# EAGLE design ghetto_distortion (EAGLE 8.6.0)
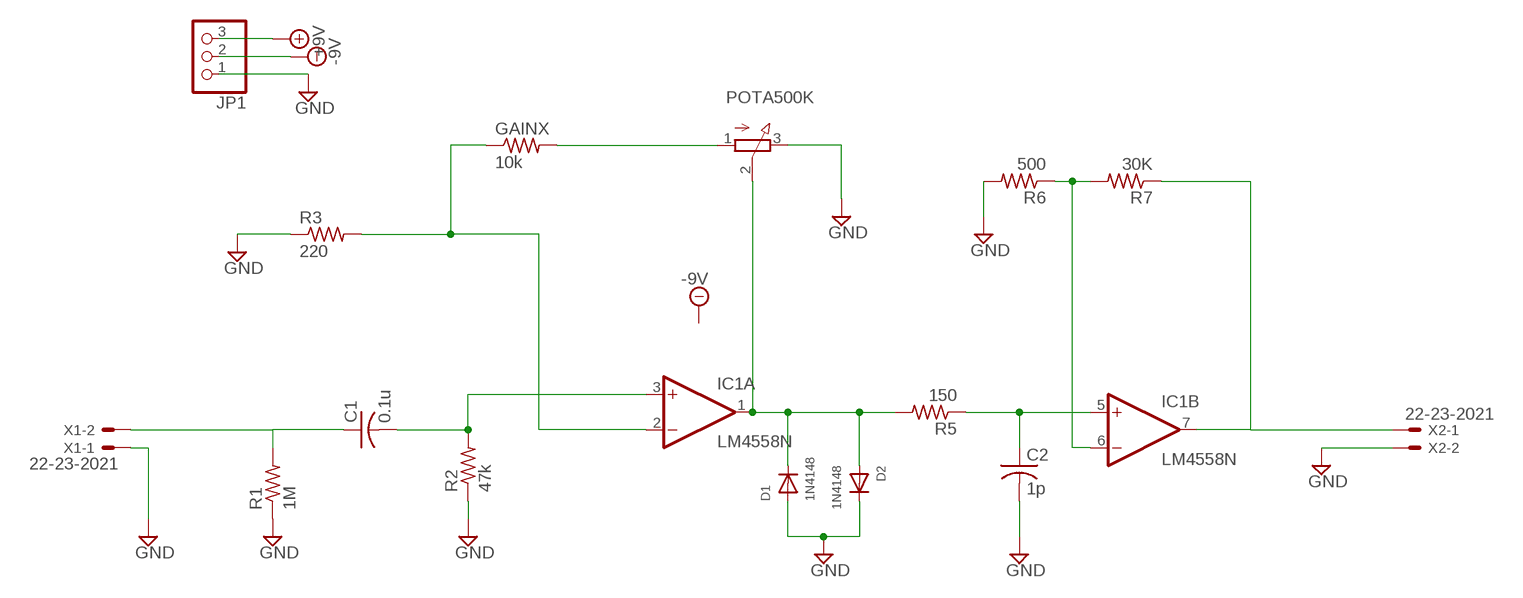
[diagram p0: schematic, sheet 1]

## Parts
C1  0.1u  C-US050-024X044  [C050-024X044]
C2  1p  C-US050-024X044  [C050-024X044]
D1  1N4148  DIODEDO-1N4148  [DO-1N4148]
D2  1N4148  DIODEDO-1N4148  [DO-1N4148]
GAINX  10k  R-US_0204/7  [0204/7]
IC1  LM4558N  [DIL08]
JP1  PINHD-1X3  [1X03]
POTA500K  3RP/1610N  [3RP/1610N]
R1  1M  R-US_0204/7  [0204/7]
R2  47k  R-US_0204/7  [0204/7]
R3  220  R-US_0204/7  [0204/7]
R5  150  R-US_0204/7  [0204/7]
R6  500  R-US_0204/7  [0204/7]
R7  30K  R-US_0204/7  [0204/7]
X1  22-23-2021  [22-23-2021]
X2  22-23-2021  [22-23-2021]

## Nets
GND: C2.2 D1.A D2.C JP1.1 POTA500K.3(E) R1.1 R2.1 R3.1 R6.2 X1.1 X2.2
N$1: C1.2 IC1.3(A:+IN) R2.2
N$2: C1.1 R1.2 X1.2
N$3: GAINX.1 IC1.2(A:-IN) R3.2
N$4: D1.C D2.A IC1.1(A:OUT) POTA500K.2(S) R5.2
N$5: C2.1 IC1.5(B:+IN) R5.1
N$6: IC1.7(B:OUT) R7.1 X2.1
N$7: GAINX.2 POTA500K.1(A)
N$8: IC1.6(B:-IN) R6.1 R7.2
V+: JP1.3 ; supply symbol labelled +9V
V-: JP1.2 ; supply symbol labelled -9V

## Power pins joined to a net without a drawn wire
V+: IC1.8(P:V+)
V-: IC1.4(P:V-)

## Library data of the parts
C1 C2 = resistor:C-US: CAPACITOR, American symbol
D1 D2 = adafruit:DIODE: Diode SMADIODE - SMA Surface Mount Package 20V 1A Schottky Diode Digikey: 641-1014-6-ND DO-1N4148 - Through Hole Small Current Diode SOD-123 20V 1 A (.5mV Vf) Schottky Diode - Digikey: MBRX120TPMSCT-ND SOD-323 10V 570mA (.38mV Vf, 3ns) Schottky Diode - Digikey: ZLLS410CT-ND SOD-523 30V 30mA Schottky Diode (RB751S-40TE61) - Digikey: RB751S-40TE61CT-ND SOT23-R/W - SOT23 Package (R = Solder Paste/Reflow Ovens, W = Hand-Soldering) BAT54Film 40V 300mA - Digikey: 497-7162-1-ND
GAINX R1-R3 R5-R7 = resistor:R-US_: RESISTOR, American symbol
IC1 = linear:*4558: OP AMP
JP1 = adafruit:PINHD-1X3: PIN HEADER
POTA500K = pot:3RP/1610N: 16mm Potentiometer one level Source: http://www.alphapotentiometers.net/html/16mm_pot_2.html
X1 X2 = con-molex:22-23-2021: .100" (2.54mm) Center Header - 2 Pin; MF: MOLEX; MPN: 22-23-2021; OC_FARNELL: 1462926; OC_NEWARK: 25C3832

## Board
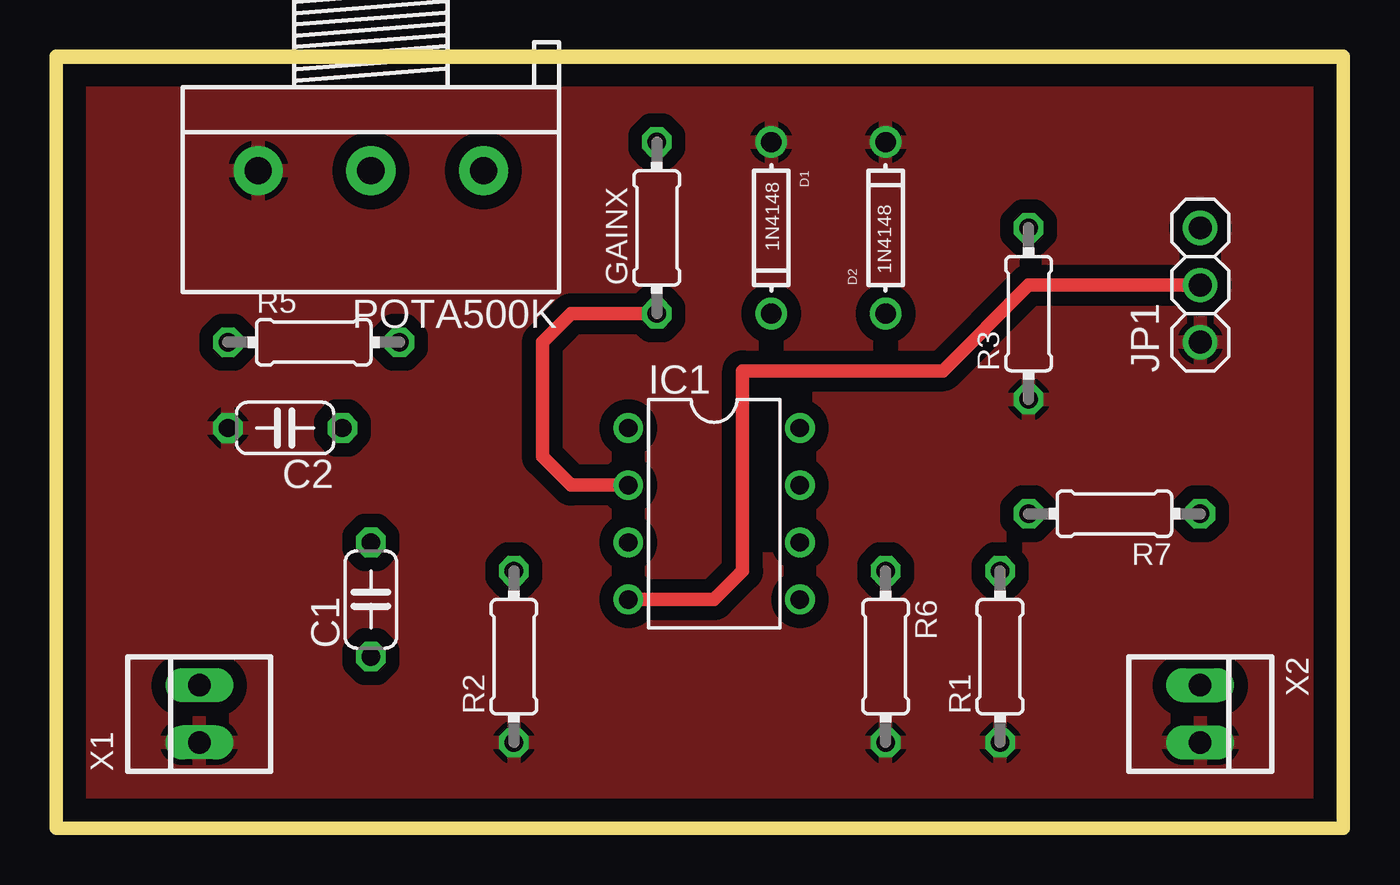
[diagram p1: board, top side]
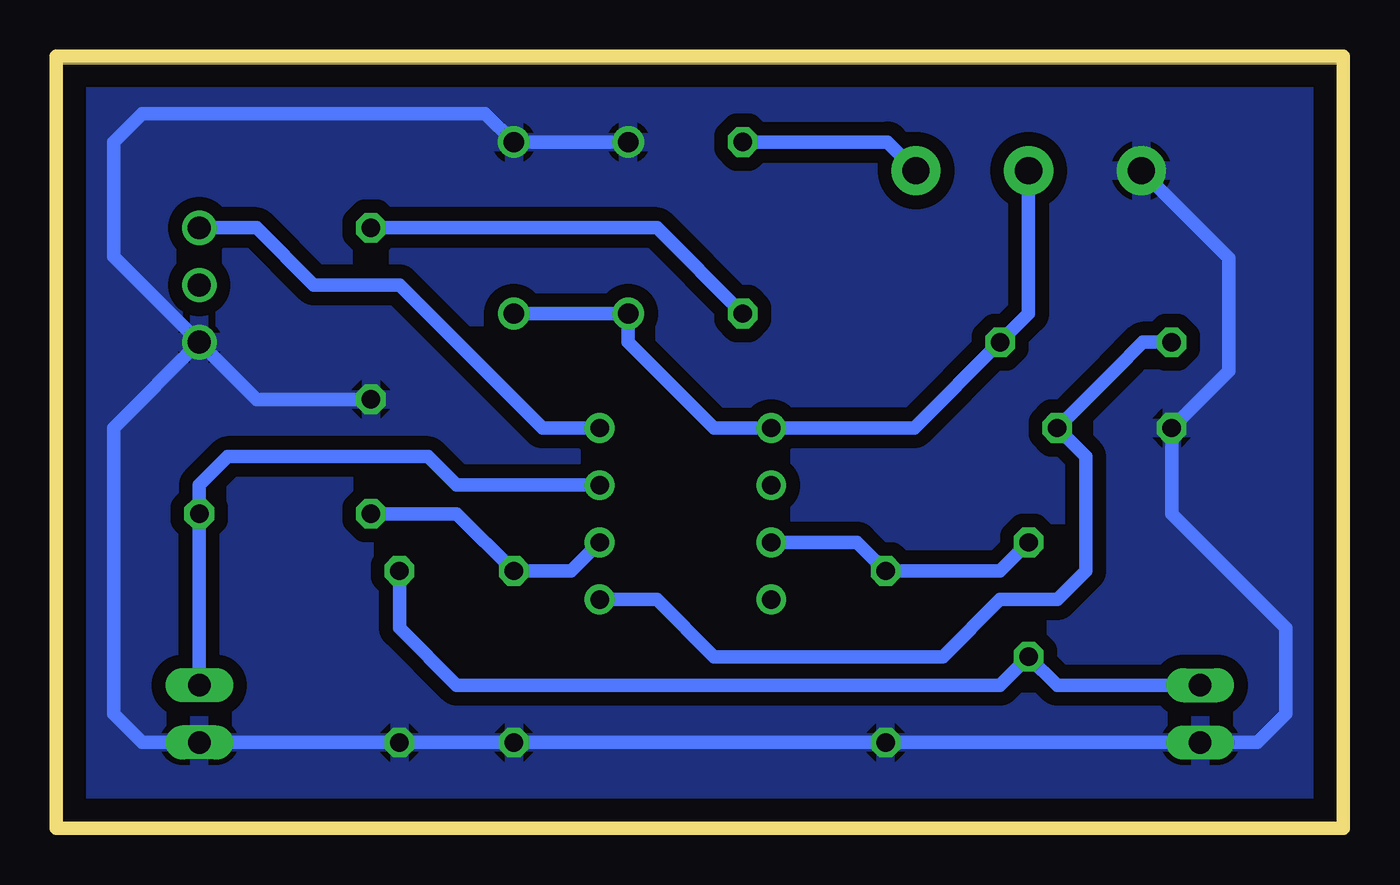
[diagram p2: board, bottom side, seen from below]

Size 57.15 x 34.29 mm. Coordinates in mm from the lower left corner, seen from the top.
Outline: 0,0 57.13,0 57.13,33.96 0,33.96 0,0
Outline: 0,0 57.15,0 57.15,34.29 0,34.29 0,0
Copper layers (1*16): Top 0.035mm / dielectric 1.5mm / Bottom 0.035mm
Design rules "default": minimum track width 6mil, minimum drill 0.35mm, track to track 6mil, track to pad 6mil, pad to pad 6mil, via to via 6mil, smd to smd 6mil, copper to edge 40mil, drill to drill 6mil, minimum pad ring 10mil, minimum via ring 8mil, stop-mask expansion 4mil, vias tented up to drill 0mil, thermal gap 10mil

### Footprints (pad centres in the part's own frame; a part is rotated, then mirrored left to right if it is on the bottom)
C050-024X044 = drill 0.813 octagon: 1 -2.54,0; 2 2.54,0
DO-1N4148 = drill 0.9: A -3.81,0; C 3.81,0
0204/7 = drill 0.813 octagon: 1 -3.81,0; 2 3.81,0
DIL08 = drill 0.813 pad 1.27: 1 -3.81,-3.81; 2 -1.27,-3.81; 3 1.27,-3.81; 4 3.81,-3.81; 5 3.81,3.81; 6 1.27,3.81; 7 -1.27,3.81; 8 -3.81,3.81
1X03 = drill 1.016: 1 -2.54,0; 2 0,0; 3 2.54,0
3RP/1610N = drill 1.2 pad 2.184: 1 -5,0; 2 0,0; 3 5,0
22-23-2021 = drill 1 long: 1 -1.27,0; 2 1.27,0

### Placement (x,y rotation side)
C1  13.97,10.16 90 top
C2  10.16,17.78 180 top
D1  31.75,26.67 270 top
D2  36.83,26.67 90 top
GAINX  26.67,26.67 90 top
IC1  29.21,13.97 270 top
JP1  50.8,24.13 90 top
POTA500K  13.97,29.21 180 top
R1  41.91,7.62 90 top
R2  20.32,7.62 90 top
R3  43.18,22.86 90 top
R5  11.43,21.59 0 top
R6  36.83,7.62 270 top
R7  46.99,13.97 180 top
X1  6.35,5.08 90 top
X2  50.8,5.08 270 top

### Tracks (layer width: path | path; a pad name or v marks a point on that pad's centre or on a via)
GND
  Bottom 0.61: JP1.1 54.61,17.78 54.61,5.08 53.34,3.81 X2.2 R1.1 R6.2 R2.1 X1.1 3.81,3.81 2.54,5.08 2.54,8.89 7.62,13.97 C2.2 5.08,20.32 5.08,25.32 POTA500K.3 | R3.1 48.26,19.05 JP1.1 | JP1.1 54.61,25.4 54.61,30.48 53.34,31.75 38.1,31.75 D2.C D1.A
  pour Top (isolate 0.61): 0,0 57.15,0 57.15,34.29 0,34.29
  pour Bottom (isolate 0.61): 0,0 57.15,0 57.15,34.29 0,34.29
N$1
  Bottom 0.61: C1.2 15.24,11.43 R2.2 21.59,12.7 IC1.3
N$2
  Bottom 0.61: X1.2 12.7,6.35 C1.1 15.24,6.35 39.37,6.35 41.91,8.89 R1.2
N$3
  Top 0.61: IC1.2 22.86,15.24 21.59,16.51 21.59,21.59 22.86,22.86 GAINX.1
  Bottom 0.61: GAINX.1 30.48,26.67 R3.2
N$4
  Bottom 0.61: POTA500K.2 13.97,22.86 R5.2 19.05,17.78 IC1.1 27.94,17.78 31.75,21.59 D1.C 34.29,22.86 D2.A
N$5
  Bottom 0.61: IC1.5 30.48,10.16 27.94,7.62 17.78,7.62 15.24,10.16 12.7,10.16 11.43,11.43 11.43,16.51 C2.1 10.16,20.32 8.89,21.59 R5.1
N$6
  Bottom 0.61: X2.1 R7.1 50.8,15.24 49.53,16.51 40.64,16.51 39.37,15.24 IC1.7
N$7
  Bottom 0.61: POTA500K.1 20.24,30.48 GAINX.2
N$8
  Bottom 0.61: IC1.6 34.29,11.43 R6.1 39.37,13.97 R7.2
V+
  Bottom 0.61: IC1.8 35.56,17.78 41.91,24.13 45.72,24.13 48.26,26.67 JP1.3
V-
  Top 0.61: IC1.4 29.21,10.16 30.48,11.43 30.48,20.32 39.37,20.32 43.18,24.13 JP1.2